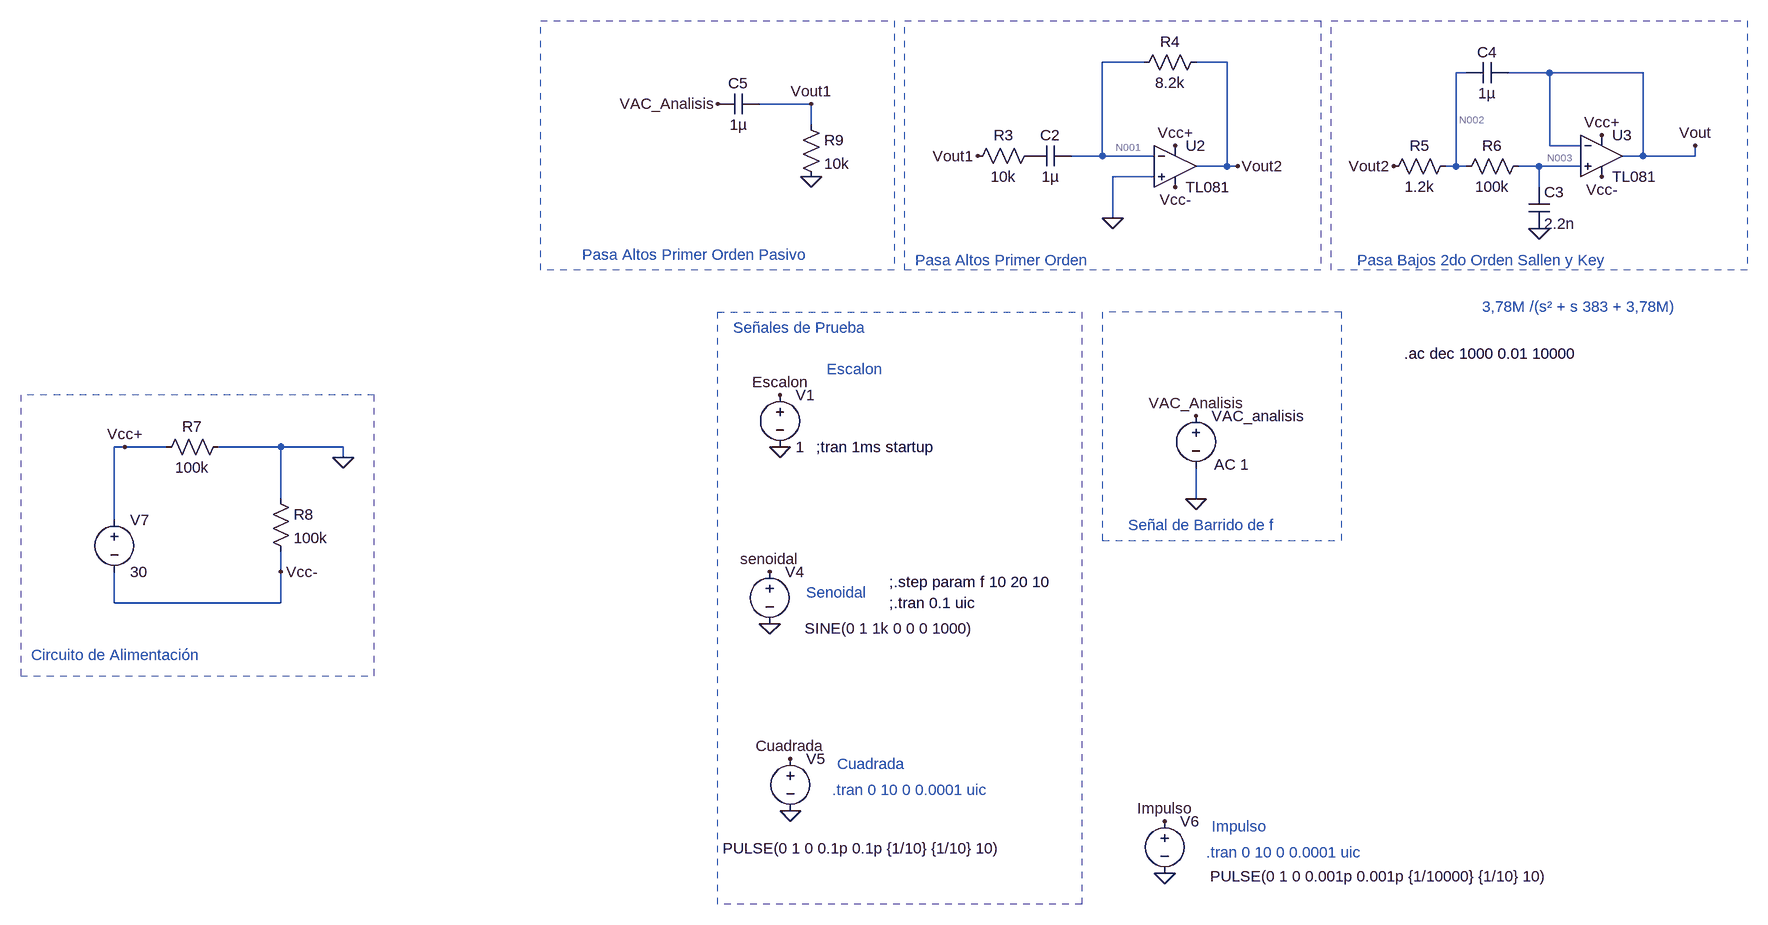
[diagram p0: schematic Seba_L_tp.asc]
* Seba_L_tp.asc
V1 Escalon 0 1
V4 senoidal 0 SINE(0 1 1k 0 0 0 1000)
V5 Cuadrada 0 PULSE(0 1 0 0.1p 0.1p {1/10} {1/10} 10)
VAC_analisis VAC_Analisis 0 AC 1
* U3: TL081 (symbol OpAmps\TL081 not available, pins judged from their places): In+=N003 In-=Vout V+=Vcc+ V-=Vcc- OUT=Vout
R5 N002 Vout2 1.2k
R6 N003 N002 100k
C3 N003 0 2.2n
C4 Vout N002 1µ
V6 Impulso 0 PULSE(0 1 0 0.001p 0.001p {1/10000} {1/10} 10)
R3 P001 Vout1 10k
* U2: TL081 (symbol OpAmps\TL081 not available, pins judged from their places): In+=0 In-=N001 V+=Vcc+ V-=Vcc- OUT=Vout2
C2 N001 P001 1µ
R4 Vout2 N001 8.2k
V7 Vcc+ Vcc- 30
R7 0 Vcc+ 100k
R8 0 Vcc- 100k
C5 Vout1 VAC_Analisis 1µ
R9 Vout1 0 10k
;tran 1ms startup
* Escalon
;.tran 0.1 uic
;.step param f 10 20 10
* Senoidal
* .tran 0 10 0 0.0001 uic
* Cuadrada
* .tran 0 10 0 0.0001 uic
* Impulso
* Circuito de Alimentación
* Pasa Altos Primer Orden
* Pasa Bajos 2do Orden Sallen y Key
* Señales de Prueba
* Señal de Barrido de f
* Pasa Altos Primer Orden Pasivo
* 3,78M /(s² + s 383 + 3,78M)
.ac dec 1000 0.01 10000
.backanno
.end

* Results of the author's LTspice run, read from the files saved beside the schematic
* Operating Point, zero values left out:
*   V(n003) = 8.154 µV
*   V(vcc+) = 15.04 V
*   V(vout2) = 12.71 µV
*   V(escalon) = 1 V
*   V(vout) = 20.49 µV
*   V(vcc-) = -14.96 V
*   V(n002) = 12.66 µV
*   V(n001) = 12.34 µV
*   I(R6) = -45.01 pA
*   I(R4) = 45.01 pA
*   I(V7) = -28.54 mA
*   I(R8) = 149.6 µA
*   I(R5) = -45.01 pA
*   I(R7) = -150.4 µA
*   Ix(u2:1) = 45.01 pA
*   Ix(u2:2) = 45.01 pA
*   Ix(u2:3) = 14.19 mA
*   Ix(u2:4) = -14.19 mA
*   Ix(u2:5) = -90.02 pA
*   Ix(u3:1) = 45.01 pA
*   Ix(u3:2) = 45.01 pA
*   Ix(u3:3) = 14.19 mA
*   Ix(u3:4) = -14.19 mA
*   Ix(u3:5) = -45.01 pA
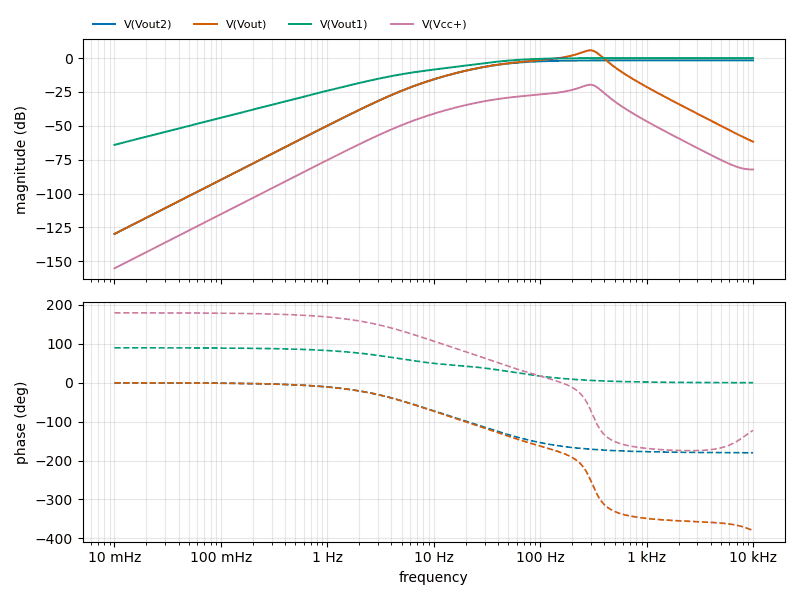
[diagram p1: AC Analysis of Seba_L_tp.asc, plotted from the saved traces]
* AC Analysis, 1 run:
*   V(Vout2): -129.80 dB at 10 mHz, -1.72 dB at 10 kHz, peak -1.72 dB at 10 kHz, 3 dB below the peak at 42.53 Hz
*   V(Vout): -129.80 dB at 10 mHz, -61.71 dB at 10 kHz, peak 5.66 dB at 295.1 Hz, 3 dB below the peak at 216.9 Hz and 357.4 Hz
*   V(Vout1): -64.04 dB at 10 mHz, -0.00 dB at 10 kHz, peak -0.00 dB at 10 kHz, 3 dB below the peak at 36.27 Hz
*   V(Vcc+): -155.16 dB at 10 mHz, -82.19 dB at 10 kHz, peak -19.71 dB at 295.1 Hz, 3 dB below the peak at 216.9 Hz and 357.4 Hz